# Altium schematic sheet PAGE112.SchDoc
size 246 x 182 mm
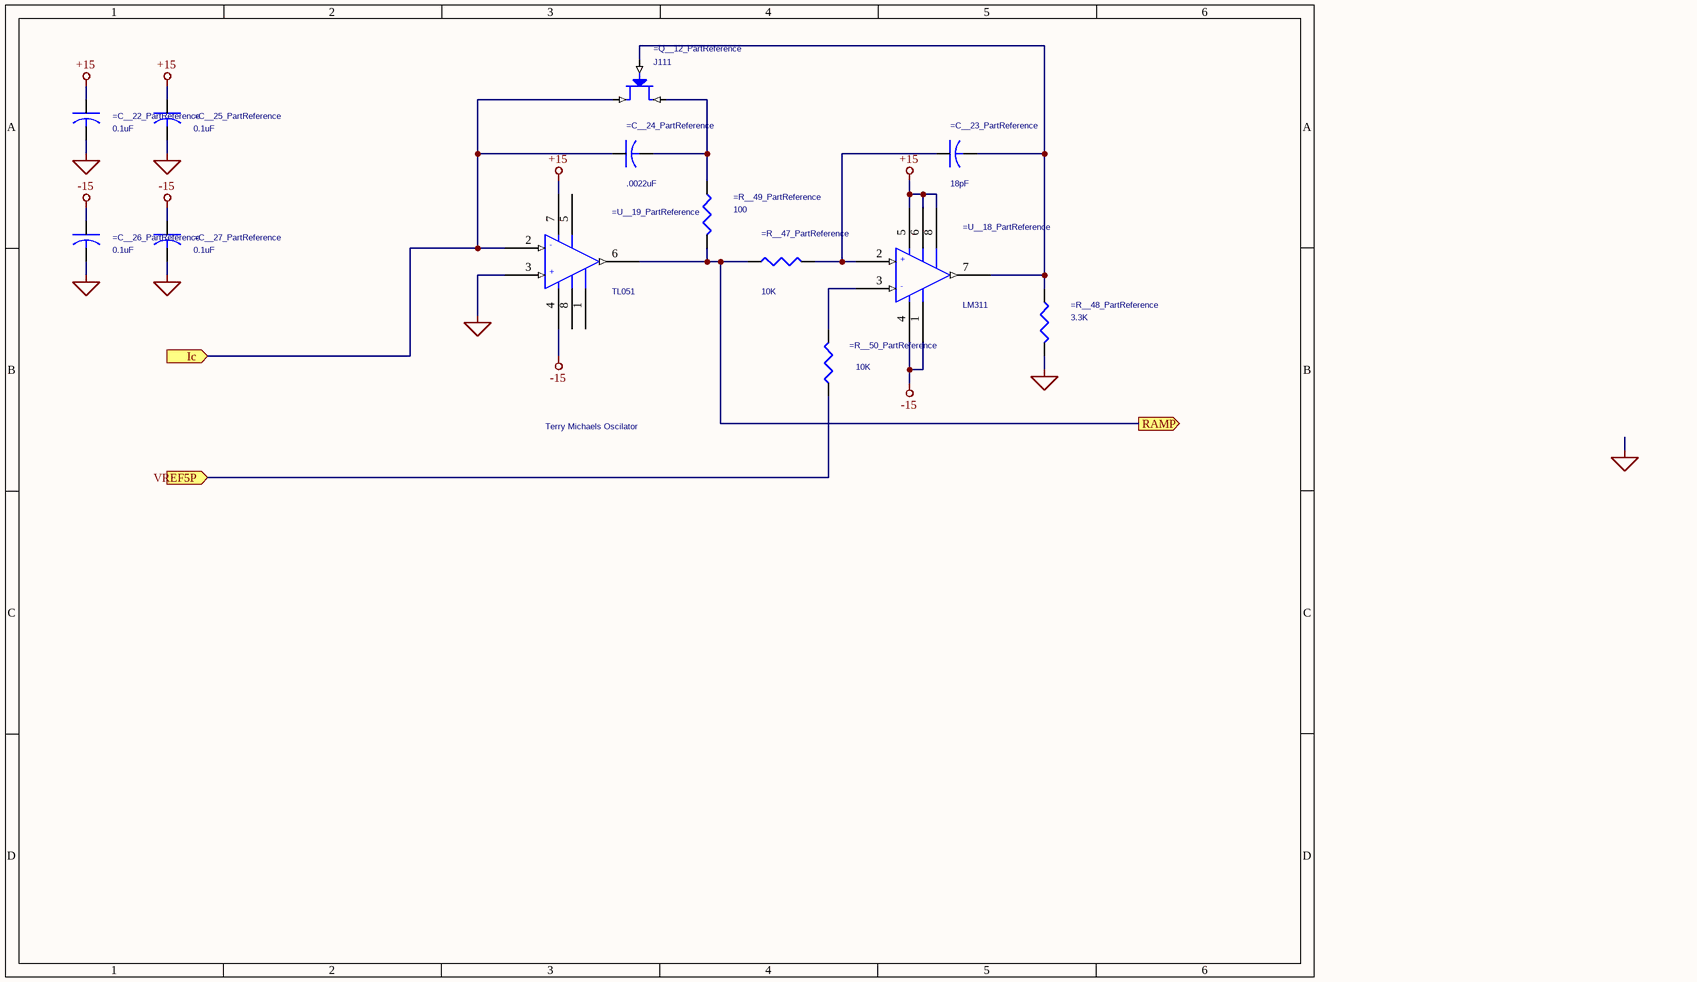
[diagram p0: PAGE112.SchDoc]

## Parts
=C__22_PartReference  0.1uF  [AXIALCAP0.3]
=C__23_PartReference  18pF  [RAD0.1]
=C__24_PartReference  .0022uF  [AXIAL0.5X0.2]
=C__25_PartReference  0.1uF  [AXIALCAP0.3]
=C__26_PartReference  0.1uF  [AXIALCAP0.3]
=C__27_PartReference  0.1uF  [AXIALCAP0.3]
=Q__12_PartReference  J111  [TO92-J111]
=R__47_PartReference  10K  [AXIAL0.4]
=R__48_PartReference  3.3K  [AXIAL0.4]
=R__49_PartReference  100  [AXIAL0.4]
=R__50_PartReference  10K  [AXIAL0.4]
=U__18_PartReference  LM311  [DIP8]
=U__19_PartReference  TL051  [DIP8]

## Ports
Ic (in), RAMP (out), VREF5P (in)

## Nets
+15: =C__22_PartReference.1 =C__25_PartReference.1 =U__18_PartReference.5(BALANCE) =U__18_PartReference.6(BAL/STROBE) =U__18_PartReference.8(V+) =U__19_PartReference.7(V+)
-15: =C__26_PartReference.1 =C__27_PartReference.1 =U__18_PartReference.1(GND) =U__18_PartReference.4(V-) =U__19_PartReference.4(V-)
GND: =C__22_PartReference.2 =C__25_PartReference.2 =C__26_PartReference.2 =C__27_PartReference.2 =R__48_PartReference.2 =U__19_PartReference.3(+IN)
Ic: =C__24_PartReference.1 =Q__12_PartReference.SOURCE =U__19_PartReference.2(-IN) ; port Ic
RAMP: =R__47_PartReference.1 =R__49_PartReference.2 =U__19_PartReference.6(OUT) ; port RAMP
VREF5P: =R__50_PartReference.1 ; port VREF5P
Net=C__23_PartReference_1: =C__23_PartReference.1 =R__47_PartReference.2 =U__18_PartReference.2(+IN)
Net=C__23_PartReference_2: =C__23_PartReference.2 =Q__12_PartReference.GATE =R__48_PartReference.1 =U__18_PartReference.7(OUT)
Net=C__24_PartReference_2: =C__24_PartReference.2 =Q__12_PartReference.DRAIN =R__49_PartReference.1
Net=R__50_PartReference_2: =R__50_PartReference.2 =U__18_PartReference.3(-IN)

Not connected (* = marked no-connect by the designer): =U__19_PartReference 1(COMP3) 5(COMP1) 8(COMP2)

## Notes on the sheet
- Terry Michaels Oscilator
- (in symbol GENERIC OPAMP) -; +
- (in symbol LM311) +; -

## Library data of the parts
=C__22_PartReference =C__25_PartReference =C__26_PartReference =C__27_PartReference = CAP_Dup1: PART NO: 80-C410C104M5U
=C__23_PartReference = CAP_Dup1: PART NO: 140-50N2-180J
=C__24_PartReference = CAP_Dup1: PART NO: 23PS310
=Q__12_PartReference = JFET N: PART NO: J111
=R__47_PartReference =R__50_PartReference = R_Dup1: PART NO: 271-10K; MOUSER PN: 271-10K-RC
=R__48_PartReference = R_Dup1: PART NO: 271-3.3K; MOUSER PN: 271-3.3K-RC
=R__49_PartReference = R_Dup1: PART NO: 271-100; MOUSER PN: 271-100-RC
=U__18_PartReference = LM311: PART NO: 511-LM311; DIGIKEY PN: 296-1389-5-ND
=U__19_PartReference = GENERIC OPAMP: MOUSER PN: 595-TL051ACP